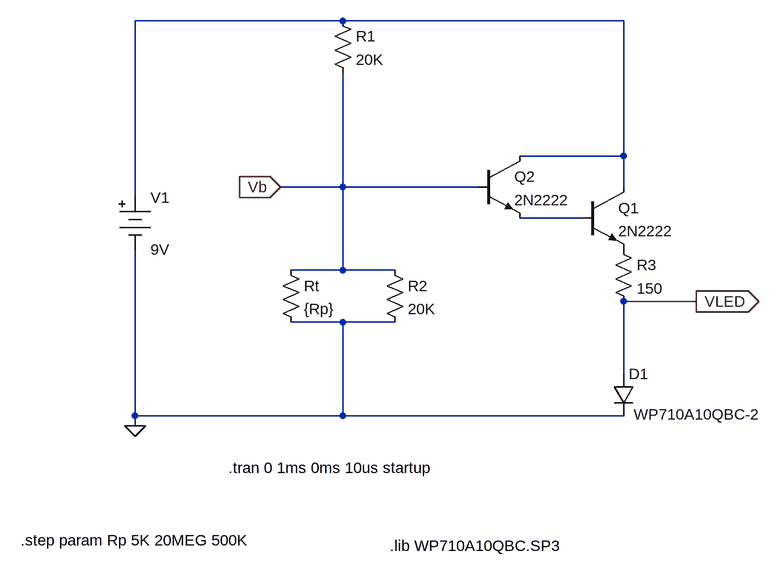
[diagram p0: schematic Thermistor Parallel Circuit.asc]
Thermistor Parallel Circuit.asc, the LTspice schematic file:
Version 4
SHEET 1 884 952
WIRE -160 128 -480 128
WIRE 272 128 -160 128
WIRE 272 336 272 128
WIRE 272 336 112 336
WIRE -160 384 -160 208
WIRE -160 384 -256 384
WIRE 48 384 -160 384
WIRE 272 384 272 336
WIRE -480 400 -480 128
WIRE 208 432 112 432
WIRE -160 512 -160 384
WIRE -160 512 -240 512
WIRE -80 512 -160 512
WIRE 384 560 272 560
WIRE -160 592 -240 592
WIRE -80 592 -160 592
WIRE 272 672 272 560
WIRE -480 736 -480 480
WIRE -160 736 -160 592
WIRE -160 736 -480 736
WIRE 272 736 -160 736
WIRE -480 752 -480 736
FLAG -480 752 0
FLAG -256 384 Vb
IOPIN -256 384 In
FLAG 384 560 VLED
IOPIN 384 560 Out
SYMBOL res -176 112 R0
SYMATTR InstName R1
SYMATTR Value 20K
SYMBOL res -256 496 R0
SYMATTR InstName Rt
SYMATTR Value {Rp}
SYMBOL res -96 496 R0
SYMATTR InstName R2
SYMATTR Value 20K
SYMBOL res 256 464 R0
SYMATTR InstName R3
SYMATTR Value 150
SYMBOL diode 256 672 R0
WINDOW 3 32 62 Left 2
SYMATTR Value WP710A10QBC-2
SYMATTR InstName D1
SYMBOL npn 208 384 R0
SYMATTR InstName Q1
SYMATTR Value 2N2222
SYMBOL npn 48 336 R0
SYMATTR InstName Q2
SYMATTR Value 2N2222
SYMBOL Misc/battery -480 384 R0
SYMATTR InstName V1
SYMATTR Value 9V
TEXT -88 936 Left 2 !.lib WP710A10QBC.SP3
TEXT -336 816 Left 2 !.tran 0 1ms 0ms 10us startup
TEXT -656 928 Left 2 !.step param Rp 5K 20MEG 500K

The netlist it stands for:
* Thermistor Parallel Circuit.asc
R1 N001 Vb 20K
Rt Vb 0 {Rp}
R2 Vb 0 20K
R3 P001 VLED 150
D1 VLED 0 WP710A10QBC-2
Q1 N001 N002 P001 0 2N2222
Q2 N001 Vb N002 0 2N2222
V1 N001 0 9V
.model D D
.lib standard.dio
.model NPN NPN
.model PNP PNP
.lib standard.bjt
.lib WP710A10QBC.SP3
.tran 0 1ms 0ms 10us startup
.step param Rp 5K 20MEG 500K
.backanno
.end